# EasyEDA schematic SCH_GM Camera Harness - 10-pin male adapter.easyeda.json
TITLE: Scematic for Male 10-pin camera breakout; REV: 1.0; Date: 2022-07-26; Sheet: 1/1; Drawn By: jshuler; Company: Jason Shuler
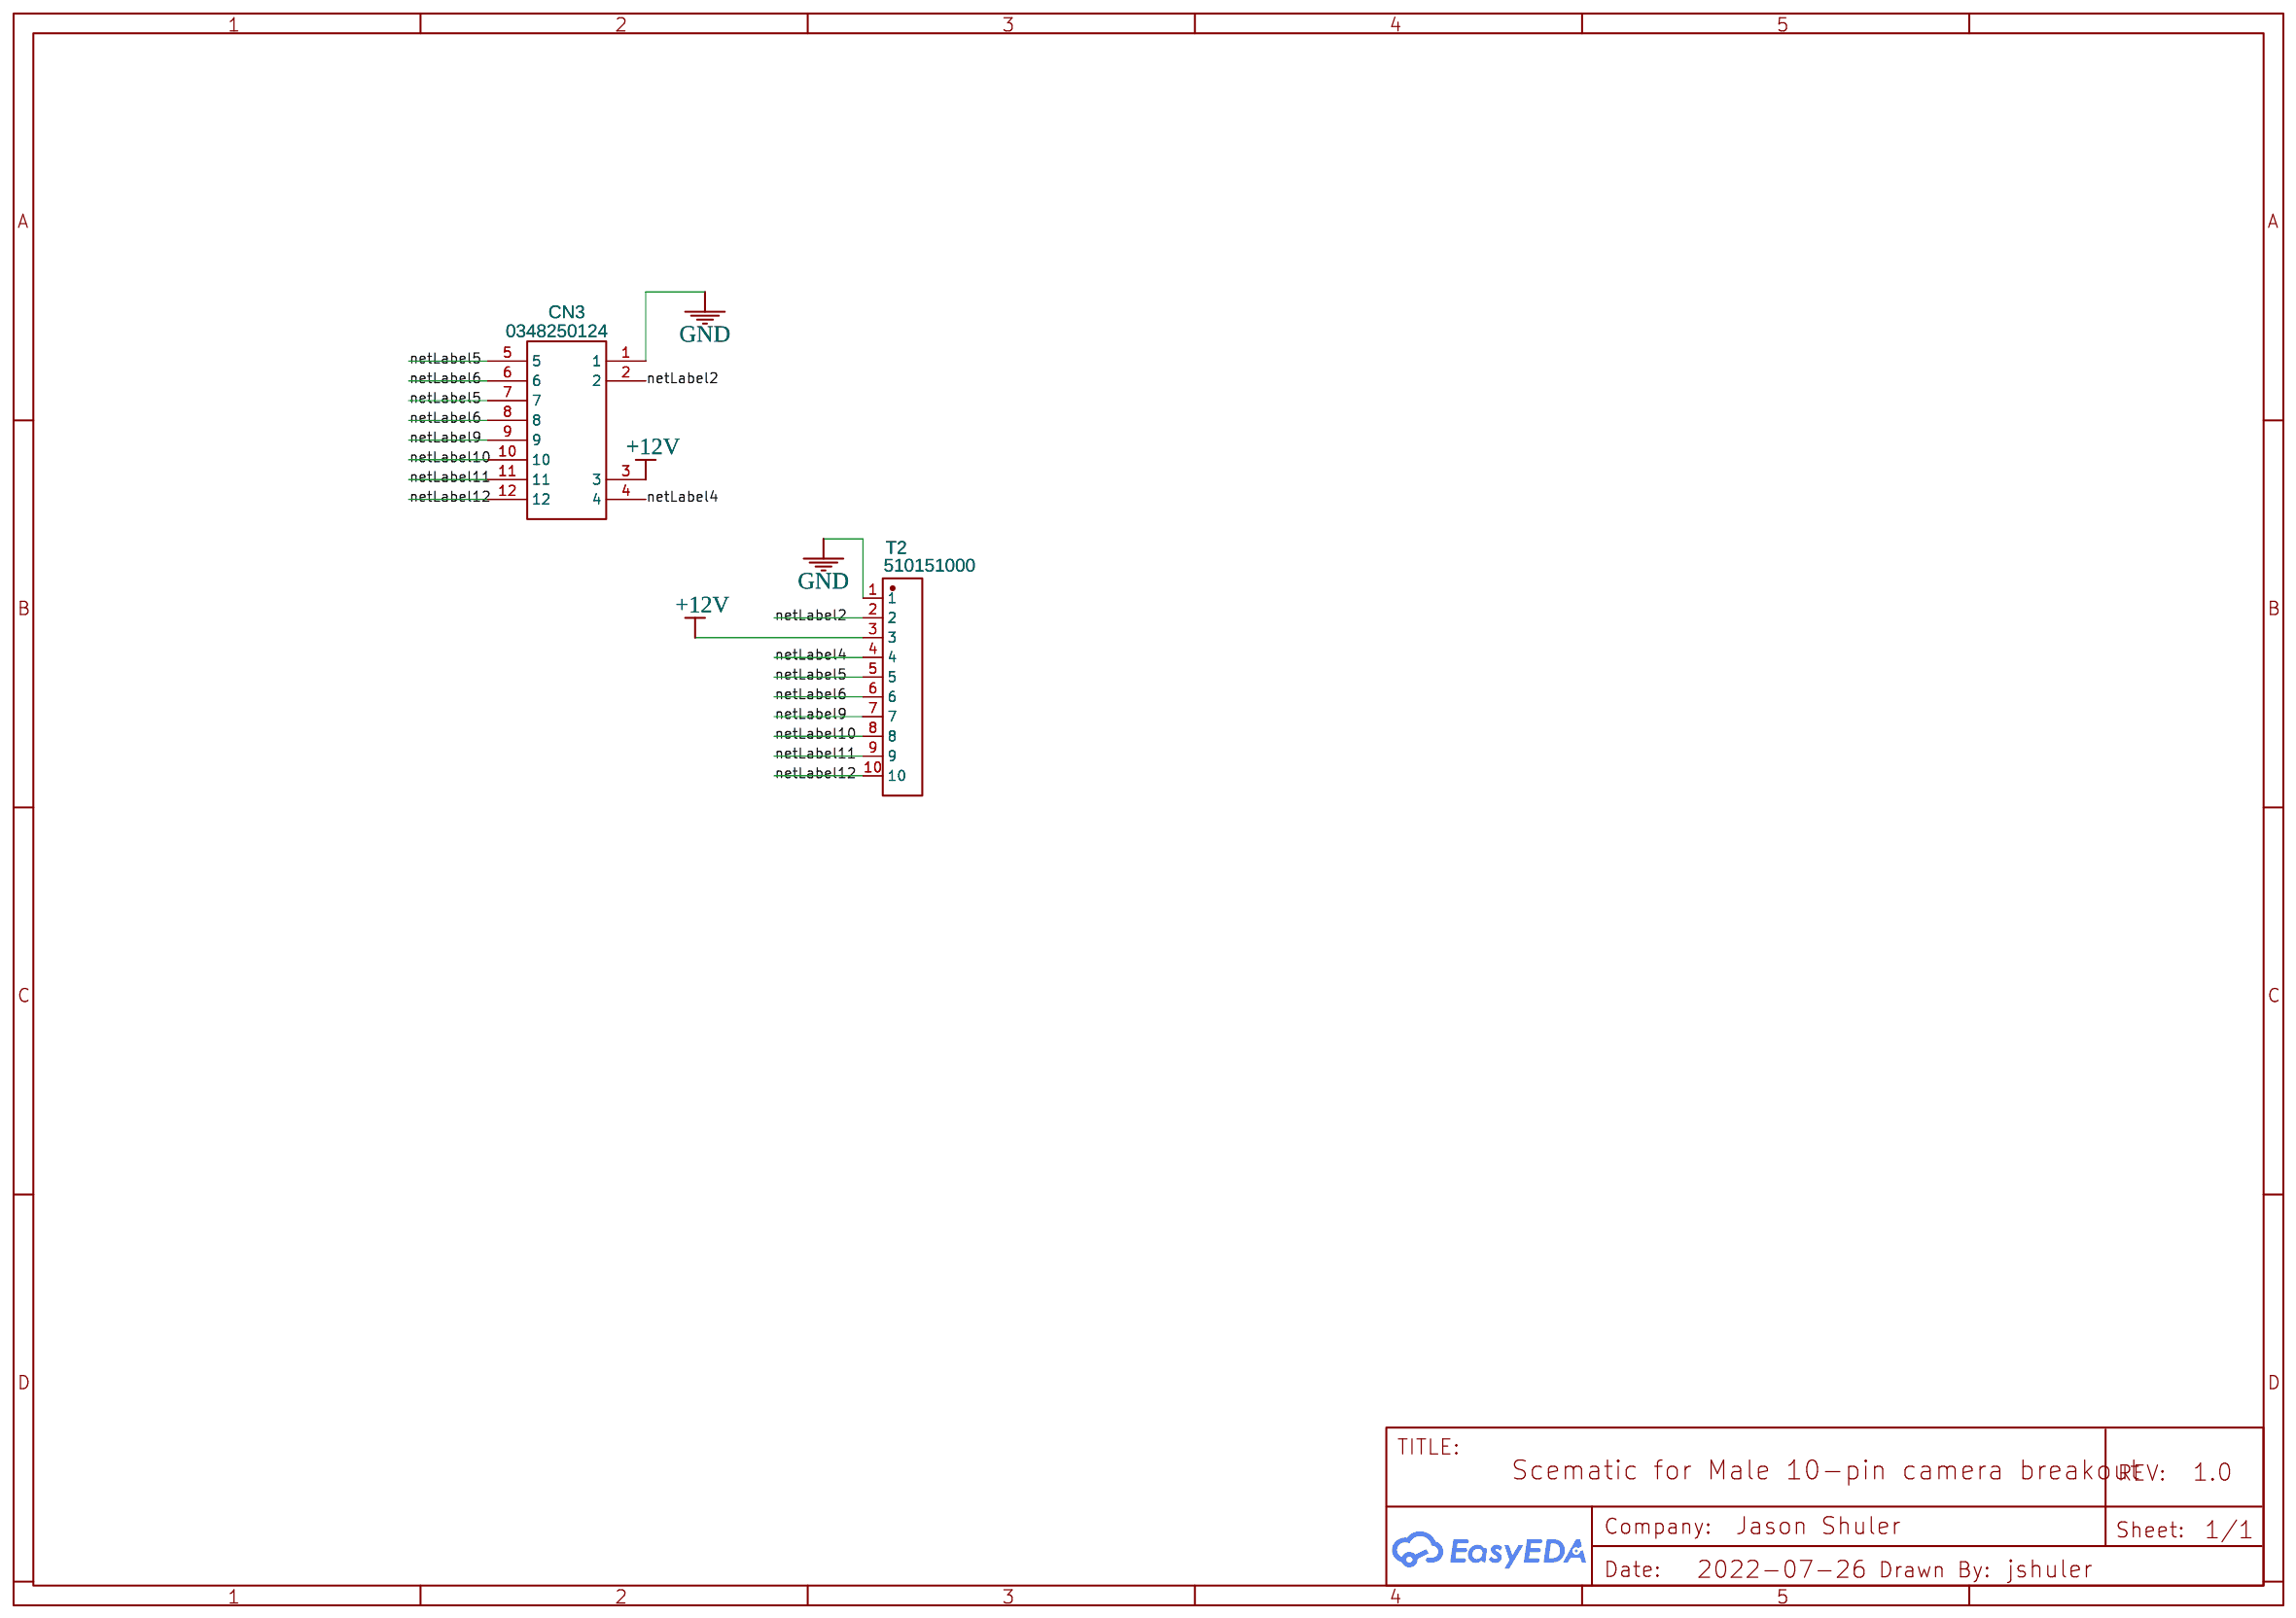
[diagram p0: schematic sheet]

## Parts
CN3  0348250124  [CONN-TH_0348250124]
T2  510151000  [510151000]

## Library data of the parts
CN3 = 0348250124: Supplier: LCSC; Supplier Part: C122393; Manufacturer: MOLEX; Contributor: LCSC
T2 = 510151000: Manufacturer: Molex; Supplier: Mouser; Contributor: jshuler

## Nets
+12V: CN3.3 T2.3
GND: CN3.1 T2.1
netLabel2: CN3.2 T2.2
netLabel4: CN3.4 T2.4
netLabel5: CN3.5 CN3.7 T2.5
netLabel6: CN3.6 CN3.8 T2.6
netLabel9: CN3.9 T2.7
netLabel10: CN3.10 T2.8
netLabel11: CN3.11 T2.9
netLabel12: CN3.12 T2.10
